# Altium schematic sheet GSM.SchDoc
size A4; SheetNumber: 4; SheetTotal: 12
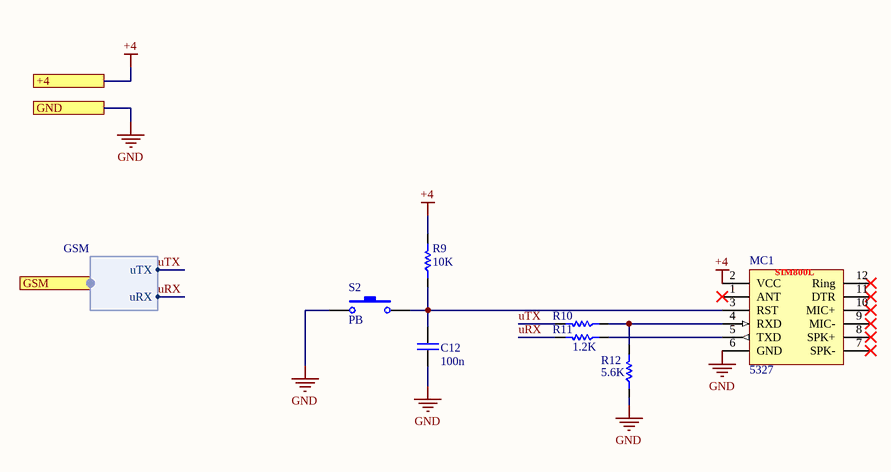
[diagram p0: GSM.SchDoc]

## Parts
C12  100n  [CAP 1206/3216]
MC1  Inflow: 5327  [Sim800L_Module]  (hidden comment: Sim800L)
R9  10K  [RES 1206 (3216X08L)]
R10  47K  [RES 1206 (3216X08L)]  (value not drawn)
R11  1.2K  [RES 1206 (3216X08L)]
R12  5.6K  [RES 1206 (3216X08L)]
S2  PB  [SW_PB_SMD_2PIN_SPST_6X3X2]

## Ports
+4, GND, GSM (harness GSM)

## Harnesses
GSM: uTX, uRX

## Nets
+4: MC1.2(VCC) R9.2 ; port +4
GND: C12.2 MC1.6(GND) R12.1 S2.2 ; port GND
uRX: R11.2 ; port GSM.uRX
uTX: R10.2 ; port GSM.uTX
NetC12_1: C12.1 MC1.3(RST) R9.1 S2.1
NetMC1_4: MC1.4(RXD) R10.1 R12.2
NetMC1_5: MC1.5(TXD) R11.1

Not connected (* = marked no-connect by the designer): MC1 1(ANT)* 7(SPK-)* 8(SPK+)* 9(MIC-)* 10(MIC+)* 11(DTR)* 12(Ring)*

## Notes on the sheet
- (in symbol ModSen_Com_Sim800L) SIM800L

## Library data of the parts
C12 = Cap_Multi_SMD_100nF_1206: Bipolar ceramic capacitor SMD; Type: MultiLayer; Inflow: inflow?; Rating: 50V; Validation: Valid; Package: 1206; Value: 100n
MC1 = ModSen_Com_Sim800L: SimCom GSM/GPRS Module; Rating: Rating?; Validation: NT; Value: Sim800L; Package: Dip; Type: GSM-GPRS
R9-R12 = Res_SMD_1206: Resistor; Inflow: inflow?; Rating: 0.25W; Validation: Valid; Package: 1206; Type: 10%
  R9: Value: 10K
  R10: Value: 47K
  R11: Value: 1.2K
  R12: Value: 5.6K
S2 = SW_PushButton_2_SMD: SMT Tactile ‎Switch; Rating: 2b; Validation: Valid; Inflow: 8260; Type: Vertical; Package: SMD; Value: PB